# EAGLE design bblaze_mainboard (EAGLE 6.4)
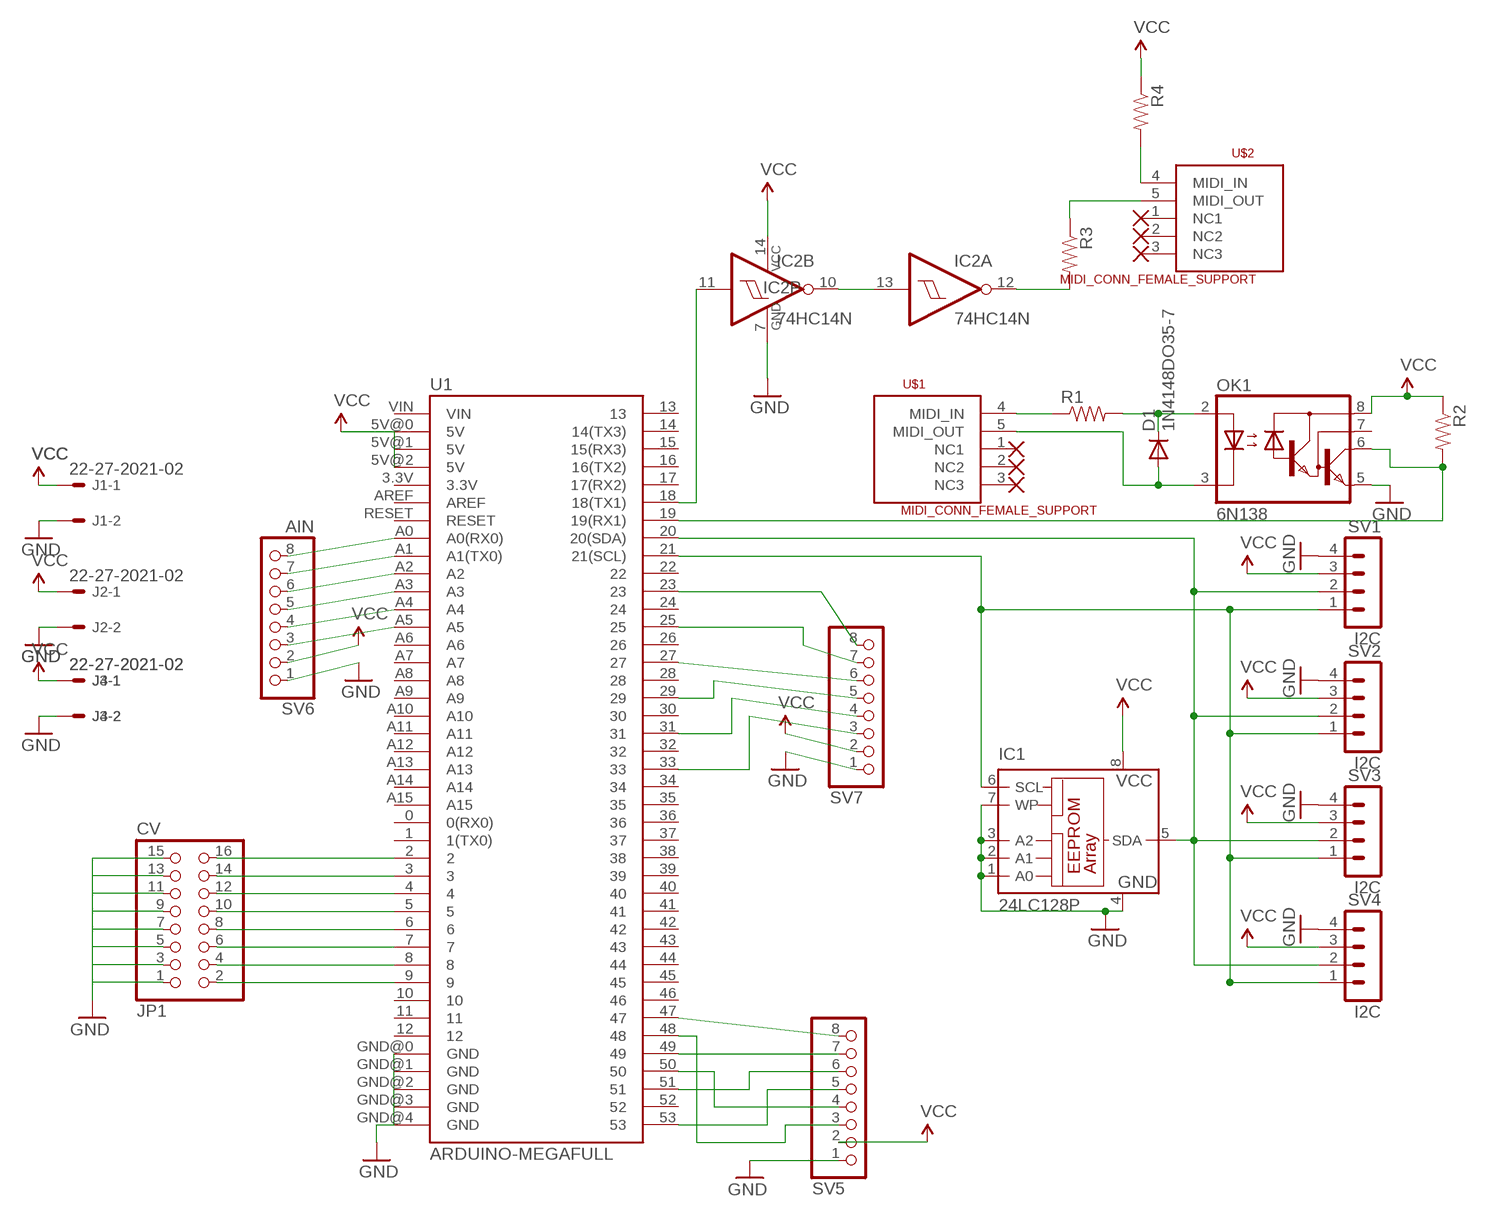
[diagram p0: schematic, sheet 1]

## Parts
D1  1N4148DO35-7  [DO35-7]
IC1  24LC128P  [DIL8]
IC2  74HC14N  [DIL14]
J1  22-27-2021-02  [6410-02]
J2  22-27-2021-02  [6410-02]
J3  22-27-2021-02  [6410-02]
J4  22-27-2021-02  [6410-02]
JP1  CV  PINHD-2X8  [2X08]
OK1  6N138  [DIL08]
R1  RESISTORKIT  [AXIAL-0.3-KIT]
R2  RESISTORKIT  [AXIAL-0.3-KIT]
R3  RESISTORKIT  [AXIAL-0.3-KIT]
R4  RESISTORKIT  [AXIAL-0.3-KIT]
SV1  I2C  MA04-1  [MA04-1]
SV2  I2C  MA04-1  [MA04-1]
SV3  I2C  MA04-1  [MA04-1]
SV4  I2C  MA04-1  [MA04-1]
SV5  PINHD-1X8  [1X08]
SV6  AIN  PINHD-1X8  [1X08]
SV7  PINHD-1X8  [1X08]
U1  ARDUINO-MEGAFULL  [ARDUINO_MEGA]
U$1  MIDI_CONN_FEMALE_SUPPORT  [DIN_5_FEMALE_SUPPORT]
U$2  MIDI_CONN_FEMALE_SUPPORT  [DIN_5_FEMALE_SUPPORT]

## Nets
GND: IC1.1(A0) IC1.2(A1) IC1.3(A2) IC1.4(GND) IC1.7(WP) IC2.7(P:GND) J1.2 J2.2 J3.2 J4.2 JP1.1 JP1.3 JP1.5 JP1.7 JP1.9 JP1.11 JP1.13 JP1.15 OK1.5(GND) SV1.4 SV2.4 SV3.4 SV4.4 SV5.1 SV6.1 SV7.1 U1.GND@0(GND) U1.GND@1(GND) U1.GND@2(GND) U1.GND@3(GND) U1.GND@4(GND)
N$1: D1.C OK1.2(A) R1.P$2
N$2: D1.A OK1.3(C) U$1.5(MIDI_OUT)
N$3: R1.P$1 U$1.4(MIDI_IN)
N$4: JP1.16 U1.2
N$5: OK1.8(VCC) R2.P$1 ; supply symbol labelled VCC
N$6: OK1.6(VO) R2.P$2 U1.19(19(RX1))
N$7: JP1.14 U1.3
N$8: IC1.5(SDA) SV1.2 SV2.2 SV3.2 SV4.2 U1.20(20(SDA))
N$9: IC1.6(SCL) SV1.1 SV2.1 SV3.1 SV4.1 U1.21(21(SCL))
N$10: JP1.12 U1.4
N$11: JP1.10 U1.5
N$12: JP1.8 U1.6
N$13: JP1.6 U1.7
N$14: JP1.4 U1.8
N$15: JP1.2 U1.9
N$16: SV5.5 U1.53
N$17: SV5.6 U1.51
N$18: SV5.4 U1.50
N$19: SV5.3 U1.48
N$21: SV5.8 U1.47
N$22: IC2.11(B:I) U1.18(18(TX1))
N$23: IC2.10(B:O) IC2.13(A:I)
N$24: IC2.12(A:O) R3.P$2
N$25: R3.P$1 U$2.5(MIDI_OUT)
N$26: R4.P$2 U$2.4(MIDI_IN)
N$27: SV6.8 U1.A0(A0(RX0))
N$28: SV6.7 U1.A1(A1(TX0))
N$29: SV6.6 U1.A2
N$30: SV6.5 U1.A3
N$31: SV6.4 U1.A4
N$32: SV6.3 U1.A5
N$33: SV7.8 U1.23
N$34: SV7.7 U1.25
N$35: SV7.6 U1.27
N$36: SV7.5 U1.29
N$37: SV7.4 U1.31
N$38: SV7.3 U1.33
N$42: SV5.7 U1.49
VCC: IC1.8(VCC) IC2.14(P:VCC) J1.1 J2.1 J3.1 J4.1 R4.P$1 SV1.3 SV2.3 SV3.3 SV4.3 SV5.2 SV6.2 SV7.2 U1.5V@0(5V) U1.5V@1(5V) U1.5V@2(5V)
Unconnected: IC2.1(D:I) IC2.2(D:O) IC2.3(E:I) IC2.4(E:O) IC2.5(F:I) IC2.6(F:O) IC2.8(C:O) IC2.9(C:I) OK1.7(VB) U1.0(0(RX0)) U1.1(1(TX0)) U1.3.3V U1.10 U1.11 U1.12 U1.13 U1.14(14(TX3)) U1.15(15(RX3)) U1.16(16(TX2)) U1.17(17(RX2)) U1.22 U1.24 U1.26 U1.28 U1.30 U1.32 U1.34 U1.35 U1.36 U1.37 U1.38 U1.39 U1.40 U1.41 U1.42 U1.43 U1.44 U1.45 U1.46 U1.52 U1.A6 U1.A7 U1.A8 U1.A9 U1.A10 U1.A11 U1.A12 U1.A13 U1.A14 U1.A15 U1.AREF U1.RESET U1.VIN U$1.1(NC1) U$1.2(NC2) U$1.3(NC3) U$2.1(NC1) U$2.2(NC2) U$2.3(NC3)

## Library data of the parts
D1 = diode:1N4148: DIODE high speed (Philips)
IC1 = microchip:24*: Serial EEPROM I2C; MF: MICROCHIP; MPN: 24LC128-I/P; OC_FARNELL: 9757929; OC_NEWARK: 12C2007
IC2 = 74xx-eu:74*14: Hex schmitt trigger INVERTER
J1-J4 = con-molex:22-?-02: CONNECTOR wire to board 2.54 mm (.1 inch) pitch header; OC_FARNELL: unknown; OC_NEWARK: unknown
JP1 = pinhead:PINHD-2X8: PIN HEADER
OK1 = optocoupler:6N138: MOTOROLA OPTO COUPLER; MF: VISHAY/TELEFUNKEN; MPN: 6N138; OC_FARNELL: 9860150; OC_NEWARK: 35K5294
R1-R4 = SparkFun-Passives:RESISTOR: Resistor Basic schematic elements and footprints for 0603, 1206, and PTH resistors.
SV1-SV4 = con-lstb:MA04-1: PIN HEADER; OC_FARNELL: unknown; OC_NEWARK: unknown
SV5-SV7 = pinhead:PINHD-1X8: PIN HEADER
U1 = SparkFun-Boards:ARDUINO-MEGA: Arduino Mega board footprint
U$1 U$2 = SparkFun-Connectors:MIDI_CONN_FEMALE_SUPPORT: MIDI connector with strain relief (DIN-5 female)

## Net classes
0 default: width 0.406 mm
1 thin: width 0.305 mm

## Board
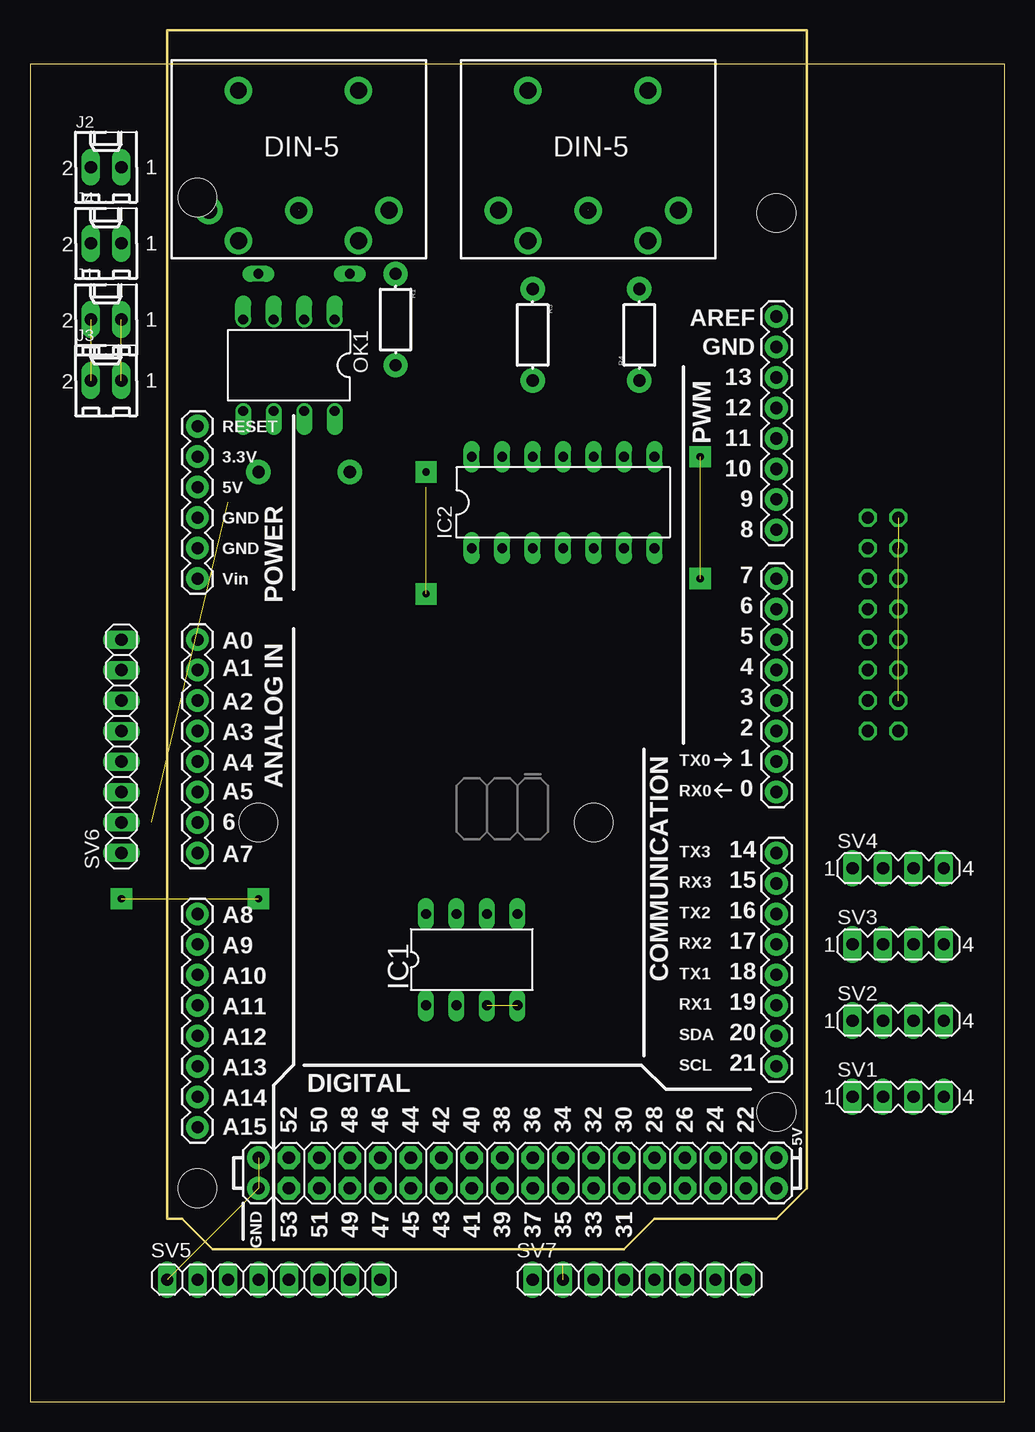
[diagram p1: board, top side]
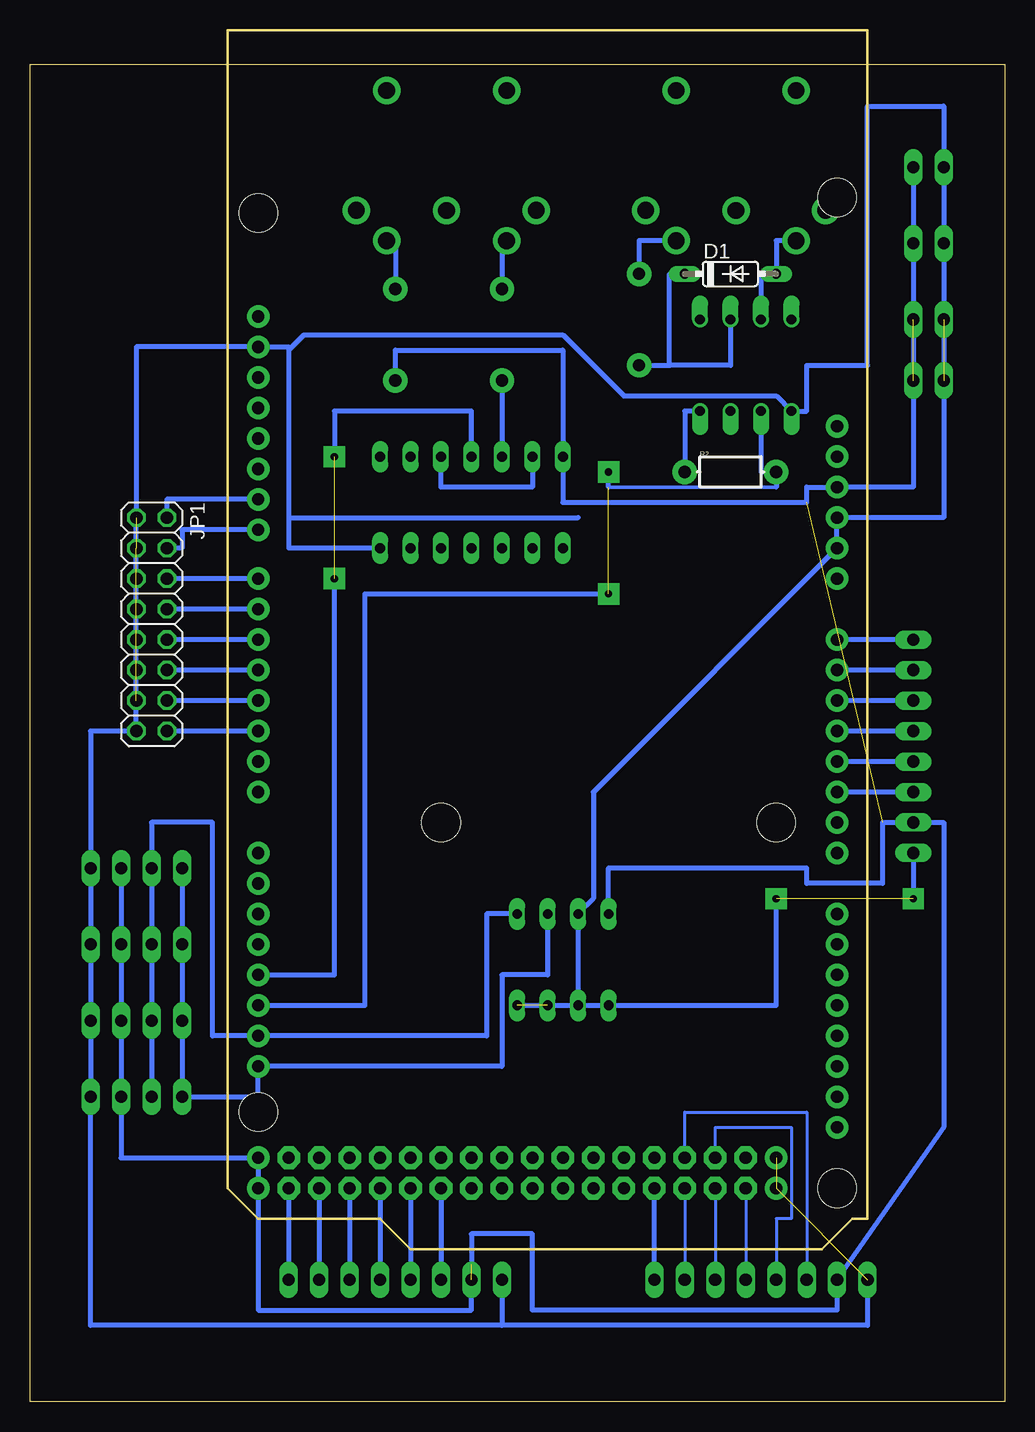
[diagram p2: board, bottom side, seen from below]

Size 81.26 x 111.43 mm. Coordinates in mm from the lower left corner, seen from the top.
Outline: 0,0 81.26,0 81.26,111.43 0,111.43 0,0
Copper layers (1*16): Top 0.035mm / dielectric 1.5mm / Bottom 0.035mm
Design rules "default": minimum track width 10mil, minimum drill 24mil, track to track 8mil, track to pad 8mil, pad to pad 8mil, via to via 8mil, smd to smd 8mil, copper to edge 40mil, drill to drill 8mil, minimum pad ring 10mil, minimum via ring 8mil, stop-mask expansion 4mil, vias tented up to drill 0mil, thermal gap 10mil

### Footprints (pad centres in the part's own frame; a part is rotated, then mirrored left to right if it is on the bottom)
DO35-7 = drill 0.813 long: A 3.81,0; C -3.81,0
DIL8 = drill 0.813 long: 1 -3.81,-3.81; 2 -1.27,-3.81; 3 1.27,-3.81; 4 3.81,-3.81; 5 3.81,3.81; 6 1.27,3.81; 7 -1.27,3.81; 8 -3.81,3.81
DIL14 = drill 0.813 long: 1 -7.62,-3.81; 2 -5.08,-3.81; 3 -2.54,-3.81; 4 0,-3.81; 5 2.54,-3.81; 6 5.08,-3.81; 7 7.62,-3.81; 8 7.62,3.81; 9 5.08,3.81; 10 2.54,3.81; 11 0,3.81; 12 -2.54,3.81; 13 -5.08,3.81; 14 -7.62,3.81
6410-02 = drill 1.016 long: 1 1.27,0; 2 -1.27,0
2X08 = drill 1.016 octagon: 1 -8.89,-1.27; 2 -8.89,1.27; 3 -6.35,-1.27; 4 -6.35,1.27; 5 -3.81,-1.27; 6 -3.81,1.27; 7 -1.27,-1.27; 8 -1.27,1.27; 9 1.27,-1.27; 10 1.27,1.27; 11 3.81,-1.27; 12 3.81,1.27; 13 6.35,-1.27; 14 6.35,1.27; 15 8.89,-1.27; 16 8.89,1.27
DIL08 = drill 0.813 offset: 1 -3.81,-3.81; 2 -1.27,-3.81; 3 1.27,-3.81; 4 3.81,-3.81; 5 3.81,3.81; 6 1.27,3.81; 7 -1.27,3.81; 8 -3.81,3.81
AXIAL-0.3-KIT = drill 1.016 pad 2.032: P$1 -3.81,0; P$2 3.81,0
MA04-1 = drill 1.016 long: 1 -3.81,0; 2 -1.27,0; 3 1.27,0; 4 3.81,0
1X08 = drill 1.016 long: 1 -8.89,0; 2 -6.35,0; 3 -3.81,0; 4 -1.27,0; 5 1.27,0; 6 3.81,0; 7 6.35,0; 8 8.89,0
ARDUINO_MEGA = drill 1.016 pad 1.88: 0 63.5,50.8; 1 60.96,50.8; 2 58.42,50.8; 3 55.88,50.8; 3.3V 35.56,2.54; 4 53.34,50.8; 5 50.8,50.8; 5V@0 38.1,2.54; 5V@1 93.98,50.8; 5V@2 96.52,50.8; 6 48.26,50.8; 7 45.72,50.8; 8 41.656,50.8; 9 39.116,50.8; 10 36.576,50.8; 11 34.036,50.8; 12 31.496,50.8; 13 28.956,50.8; 14 68.58,50.8; 15 71.12,50.8; 16 73.66,50.8; 17 76.2,50.8; 18 78.74,50.8; 19 81.28,50.8; 20 83.82,50.8; 21 86.36,50.8; A0 50.8,2.54; A1 53.34,2.54; A2 55.88,2.54; A3 58.42,2.54; A4 60.96,2.54; A5 63.5,2.54; A6 66.04,2.54; A7 68.58,2.54; A8 73.66,2.54; A9 76.2,2.54; A10 78.74,2.54; A11 81.28,2.54; A12 83.82,2.54; A13 86.36,2.54; A14 88.9,2.54; A15 91.44,2.54; AREF 23.876,50.8; GND@0 40.64,2.54; GND@1 43.18,2.54; GND@2 93.98,7.62; GND@3 96.52,7.62; GND@4 26.416,50.8; RESET 33.02,2.54; VIN 45.72,2.54 | drill 1.016 pad 1.88 octagon: 22 93.98,48.26; 23 96.52,48.26; 24 93.98,45.72; 25 96.52,45.72; 26 93.98,43.18; 27 96.52,43.18; 28 93.98,40.64; 29 96.52,40.64; 30 93.98,38.1; 31 96.52,38.1; 32 93.98,35.56; 33 96.52,35.56; 34 93.98,33.02; 35 96.52,33.02; 36 93.98,30.48; 37 96.52,30.48; 38 93.98,27.94; 39 96.52,27.94; 40 93.98,25.4; 41 96.52,25.4; 42 93.98,22.86; 43 96.52,22.86; 44 93.98,20.32; 45 96.52,20.32; 46 93.98,17.78; 47 96.52,17.78; 48 93.98,15.24; 49 96.52,15.24; 50 93.98,12.7; 51 96.52,12.7; 52 93.98,10.16; 53 96.52,10.16 | hole 3.2: 15.24,50.8; 13.97,2.54; 66.04,35.56; 66.04,7.62; 90.17,50.8; 96.52,2.54
DIN_5_FEMALE_SUPPORT = drill 1.4 pad 2.286: 1 0.46,3.61; 2 -7.07,3.6; 3 7.94,3.6; 4 -4.53,6.12; 5 5.47,6.13; 6 -4.53,-6.382; 7 5.478,-6.382

### Placement (x,y rotation side)
D1  22.86,93.98 0 bottom
IC1  36.83,36.83 0 top
IC2  44.45,74.93 0 top
J1  6.35,90.17 0 top
J2  6.35,102.87 0 top
J3  6.35,85.09 0 top
J4  6.35,96.52 0 top
JP1  71.12,64.77 270 bottom
OK1  21.59,86.36 180 top
R1  30.48,90.17 270 top
R2  22.86,77.47 0 bottom
R3  41.91,88.9 270 top
R4  50.8,88.9 90 top
SV1  72.39,25.4 0 top
SV2  72.39,31.75 0 top
SV3  72.39,38.1 0 top
SV4  72.39,44.45 0 top
SV5  20.32,10.16 0 top
SV6  7.62,54.61 90 top
SV7  50.8,10.16 0 top
U1  11.43,114.3 270 top
U$1  22.86,102.87 180 top
U$2  46.99,102.87 180 top

### Tracks (layer width: path | path; a pad name or v marks a point on that pad's centre or on a via)
GND  (via drill 0.6 pad 1.78)  (11 unrouted)
  Bottom 0.406: SV7.1 41.91,6.35 | 41.91,6.35 76.2,6.35 SV1.4 SV2.4 SV3.4 SV4.4 76.2,55.88 JP1.15 JP1.1 72.39,87.88 U1.GND@4 59.69,87.88 59.69,87.63 | IC1.4 IC1.2 | IC1.2 IC1.1 19.05,33.02 v19.05,41.91 | IC1.2 IC1.7 34.29,41.91 34.29,50.8 U1.GND@1 U1.GND@0 5.08,73.66 J3.2 J4.2 J2.2 5.08,107.95 11.43,107.95 11.43,86.36 16.51,86.36 16.51,82.55 OK1.5 19.05,83.82 31.75,83.82 36.83,88.9 58.42,88.9 59.69,87.63 | 59.69,87.63 59.69,73.66 | 59.69,73.66 59.69,71.12 IC2.7 | 59.69,73.66 35.56,73.66 | SV6.1 v7.62,41.91 | SV5.1 11.43,6.35 41.91,6.35
N$1
  Bottom 0.406: R1.P$2 27.94,86.36 | 27.94,86.36 27.94,93.98 D1.C | OK1.2 22.86,86.36 27.94,86.36
N$2
  Bottom 0.406: U$1.5 19.05,96.74 D1.A 20.32,93.98 OK1.3
N$3
  Bottom 0.406: U$1.4 30.48,96.75 R1.P$1
N$4
  Bottom 0.406: U1.2 JP1.16
N$5
  Bottom 0.406: OK1.8 26.67,82.55 R2.P$1
N$6  (via drill 0.6 pad 1.78)  (1 unrouted)
  Bottom 0.305: 19.05,76.2 33.02,76.2
  Bottom 0.406: OK1.6 20.32,77.47 R2.P$2 19.05,76.2 | 33.02,76.2 33.02,77.47 | U1.19 53.34,33.02 53.34,67.31 v33.02,67.31
N$7
  Bottom 0.406: U1.3 JP1.14
N$8
  Bottom 0.406: SV1.2 SV2.2 SV3.2 SV4.2 71.12,48.26 66.04,48.26 66.04,30.48 U1.20 43.18,30.48 43.18,40.64 IC1.5
N$9
  Bottom 0.406: SV4.1 SV3.1 SV2.1 SV1.1 62.23,25.4 U1.21 41.91,27.94 41.91,35.56 38.1,35.56 IC1.6
N$10
  Bottom 0.406: U1.4 JP1.12
N$11
  Bottom 0.406: U1.5 JP1.10
N$12
  Bottom 0.406: U1.6 JP1.8
N$13
  Bottom 0.406: U1.7 JP1.6
N$14
  Bottom 0.406: U1.8 68.58,72.64 68.58,71.12 JP1.4
N$15
  Bottom 0.406: U1.9 69.85,75.18 JP1.2
N$16
  Bottom 0.254: U1.53 SV5.5
N$17
  Bottom 0.254: U1.51 SV5.6
N$18
  Bottom 0.254: U1.50 24.13,22.86 17.78,22.86 17.78,15.24 19.05,15.24 SV5.4
N$19
  Bottom 0.254: U1.48 26.67,24.13 16.51,24.13 SV5.3
N$21
  Bottom 0.406: SV5.8 U1.47
N$22  (1 unrouted)
  Bottom 0.406: IC2.11 44.45,82.55 55.88,82.55 55.88,78.74 | U1.18 55.88,35.56 55.88,68.58
N$23
  Bottom 0.406: IC2.13 39.37,76.2 46.99,76.2 IC2.10
N$24
  Bottom 0.406: R3.P$2 IC2.12
N$25
  Bottom 0.406: U$2.5 41.91,96.74 R3.P$1
N$26
  Bottom 0.406: U$2.4 50.8,96.75 R4.P$2
N$27
  Bottom 0.406: SV6.8 U1.A0
N$28
  Bottom 0.406: SV6.7 U1.A1
N$29
  Bottom 0.406: SV6.6 U1.A2
N$30
  Bottom 0.406: SV6.5 U1.A3
N$31
  Bottom 0.406: SV6.4 U1.A4
N$32
  Bottom 0.406: SV6.3 U1.A5
N$33
  Bottom 0.406: U1.23 SV7.8
N$34
  Bottom 0.406: U1.25 SV7.7
N$35
  Bottom 0.406: U1.27 SV7.6
N$36
  Bottom 0.406: U1.29 SV7.5
N$37
  Bottom 0.406: U1.31 SV7.4
N$38
  Bottom 0.406: U1.33 SV7.3
N$39  (via drill 0.6 pad 1.78)
  other vias: 55.88,78.74
N$40  (via drill 0.6 pad 1.78)
  other vias: 55.88,68.58
N$41  (via drill 0.6 pad 1.78)
  other vias: 33.02,77.47
N$42
  Bottom 0.254: U1.49 SV5.7
VCC  (3 unrouted)
  Bottom 0.406: J2.1 J4.1 J3.1 7.62,76.2 U1.5V@0 16.51,76.2 16.51,74.93 36.83,74.93 IC2.14 36.83,87.63 50.8,87.63 R4.P$1 | SV4.3 SV3.3 SV2.3 SV1.3 73.66,20.32 U1.5V@1 U1.5V@2 62.23,7.62 44.45,7.62 SV7.2 | IC1.8 33.02,44.45 16.51,44.45 16.51,43.18 10.16,43.18 10.16,48.26 SV6.2 5.08,48.26 5.08,22.86 SV5.2 13.97,7.62 39.37,7.62 39.37,13.97 44.45,13.97 44.45,11.43